# EasyEDA schematic SCH_stm-mainboard_2026-06-05.json
TITLE: Sheet_1; REV: 1.0; Date: 2026-06-05; Sheet: 1/1; Drawn By: farrelinoazikra; Company: Your Company
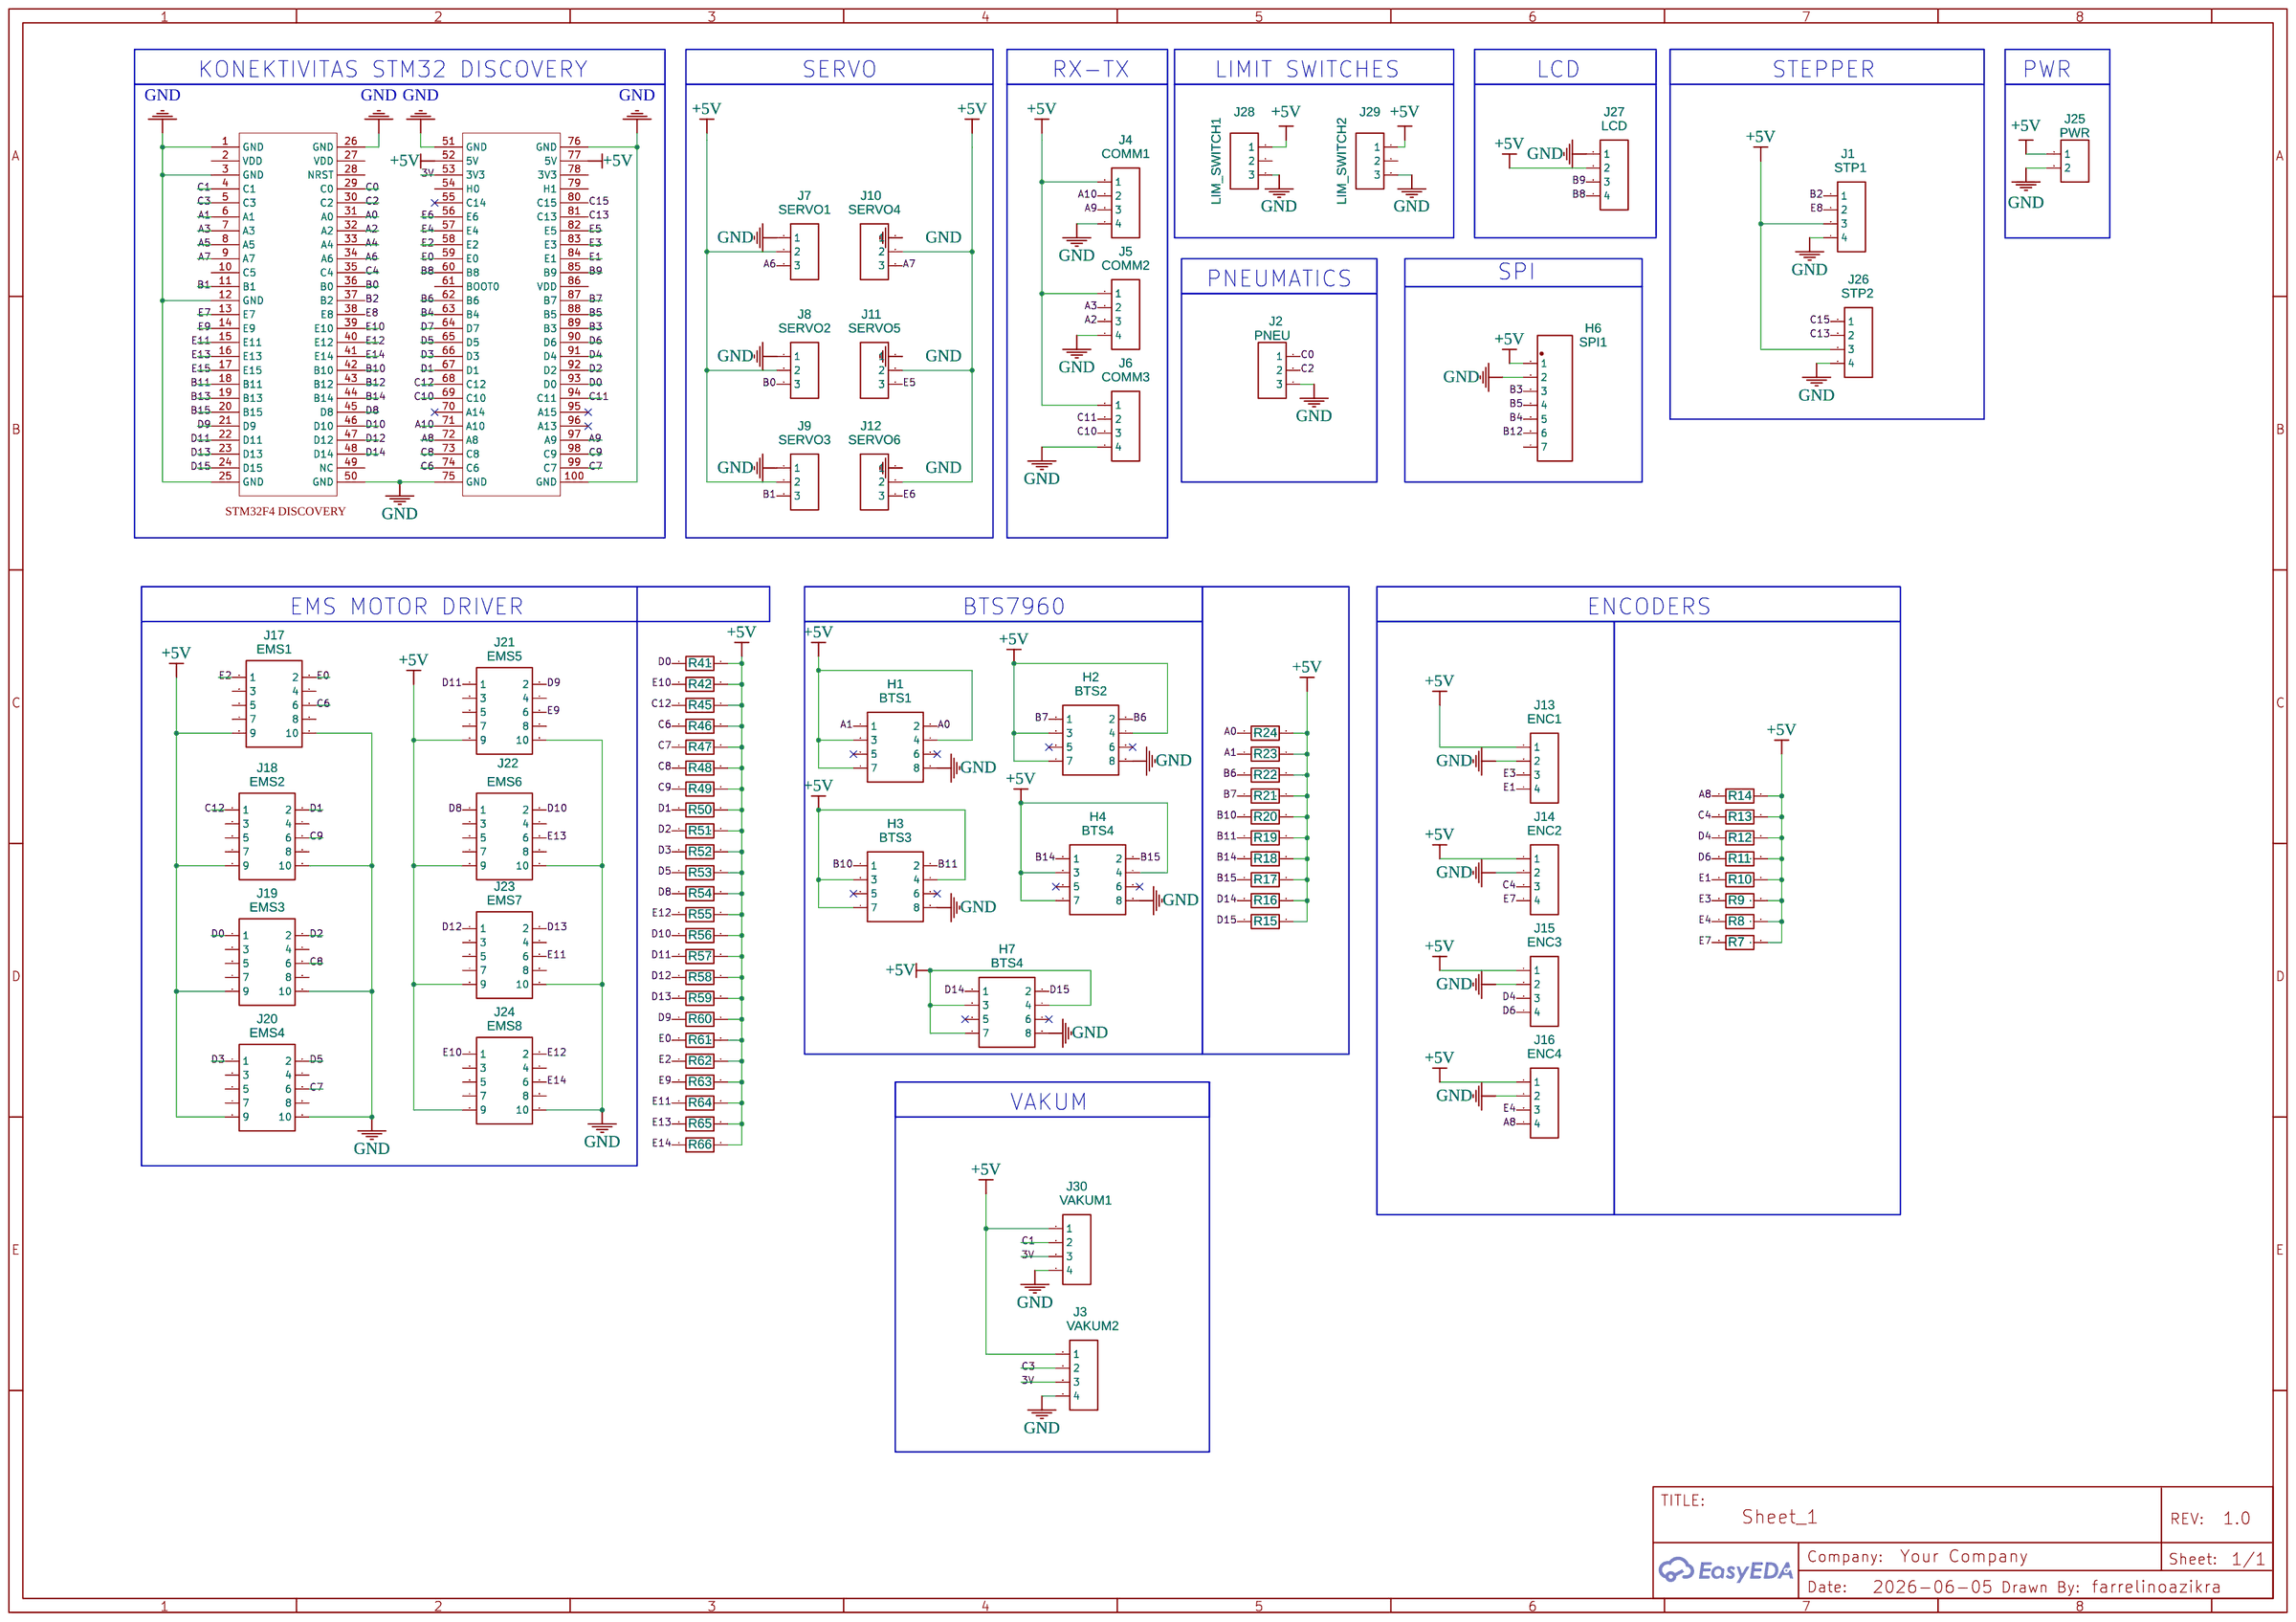
[diagram p0: schematic sheet]

## Parts
H1  BTS1  [HDR-F-2.54_2X4]
H2  BTS2  [HDR-F-2.54_2X4]
H3  BTS3  [HDR-F-2.54_2X4]
H4  BTS4  [HDR-F-2.54_2X4]
H6  SPI1  [210S-1X7P]
H7  BTS4  [HDR-F-2.54_2X4]
J1  STP1  [HDR-M-2.54_1X4]
J2  PNEU  [HDR-M-2.54_1X3]
J3  VAKUM2  [HDR-M-2.54_1X4]
J4  COMM1  [HDR-M-2.54_1X4]
J5  COMM2  [HDR-M-2.54_1X4]
J6  COMM3  [HDR-M-2.54_1X4]
J7  SERVO1  [HDR-M-2.54_1X3]
J8  SERVO2  [HDR-M-2.54_1X3]
J9  SERVO3  [HDR-M-2.54_1X3]
J10  SERVO4  [HDR-M-2.54_1X3]
J11  SERVO5  [HDR-M-2.54_1X3]
J12  SERVO6  [HDR-M-2.54_1X3]
J13  ENC1  [HDR-M-2.54_1X4]
J14  ENC2  [HDR-M-2.54_1X4]
J15  ENC3  [HDR-M-2.54_1X4]
J16  ENC4  [HDR-M-2.54_1X4]
J17  EMS1  [HDR-M-2.54_2X5]
J18  EMS2  [HDR-M-2.54_2X5]
J19  EMS3  [HDR-M-2.54_2X5]
J20  EMS4  [HDR-M-2.54_2X5]
J21  EMS5  [HDR-M-2.54_2X5]
J22  EMS6  [HDR-M-2.54_2X5]
J23  EMS7  [HDR-M-2.54_2X5]
J24  EMS8  [HDR-M-2.54_2X5]
J25  PWR  [HDR-M-2.54_1X2]
J26  STP2  [HDR-M-2.54_1X4]
J27  LCD  [HDR-M-2.54_1X4]
J28  LIM_SWITCH1  [HDR-M-2.54_1X3]
J29  LIM_SWITCH2  [HDR-M-2.54_1X3]
J30  VAKUM1  [HDR-M-2.54_1X4]
R7  1k  [R1206]
R8  1k  [R1206]
R9  1k  [R1206]
R10  1k  [R1206]
R11  1k  [R1206]
R12  1k  [R1206]
R13  1k  [R1206]
R14  1k  [R1206]
R15  1k  [R1206]
R16  1k  [R1206]
R17  1k  [R1206]
R18  1k  [R1206]
R19  1k  [R1206]
R20  1k  [R1206]
R21  1k  [R1206]
R22  1k  [R1206]
R23  1k  [R1206]
R24  1k  [R1206]
R41  1k  [R1206]
R42  1k  [R1206]
R45  1k  [R1206]
R46  1k  [R1206]
R47  1k  [R1206]
R48  1k  [R1206]
R49  1k  [R1206]
R50  1k  [R1206]
R51  1k  [R1206]
R52  1k  [R1206]
R53  1k  [R1206]
R54  1k  [R1206]
R55  1k  [R1206]
R56  1k  [R1206]
R57  1k  [R1206]
R58  1k  [R1206]
R59  1k  [R1206]
R60  1k  [R1206]
R61  1k  [R1206]
R62  1k  [R1206]
R63  1k  [R1206]
R64  1k  [R1206]
R65  1k  [R1206]
R66  1k  [R1206]
STM32F1DISCOVERY  STM32F4 Discovery  [STM32F4 DISCOVERY]

## Library data of the parts
H1-H4 H7 = HDR-F-2.54_2x4: Supplier Part: C239344; Supplier: LCSC; Contributor: LCEDA_Lib
H6 = Header-Male-2.54_1x7: Supplier: LCSC; Manufacturer: Ckmtw; Manufacturer Part: 210S-1*7P; Contributor: V.Vizniuk; Supplier Part: C124381
J1 J3-J6 J13-J16 J26 J27 J30 = HDR-M-2.54_1x4: Supplier Part: C124378; Supplier: LCSC; Contributor: LCEDA_Lib
J2 J7-J12 J28 J29 = HDR-M-2.54_1x3: Supplier Part: C180248; Supplier: LCSC; Contributor: LCEDA_Lib
J17-J24 = HDR-M-2.54_2x5: Supplier Part: C178292; Supplier: LCSC; Contributor: LCEDA_Lib
J25 = HDR-M-2.54_1x2: Supplier Part: C124375; Supplier: LCSC; Contributor: LCEDA_Lib
R7-R24 R41 R42 R45-R66 = R_1206_EU: Contributor: LCEDA_Lib
STM32F1DISCOVERY = -: Last Revision: 1 Jun 2017

## Nets
3V: J3.3 J30.3 STM32F1DISCOVERY.53(3V3)
+5V: H1.3 H1.4 H1.7 H2.3 H2.4 H2.7 H3.3 H3.4 H3.7 H4.3 H4.4 H4.7 H6.1 H7.3 H7.4 H7.7 J1.3 J3.1 J4.1 J5.1 J6.1 J7.2 J8.2 J9.2 J10.2 J11.2 J12.2 J13.1 J14.1 J15.1 J16.1 J17.9 J18.9 J19.9 J20.9 J21.9 J22.9 J23.9 J24.9 J25.1 J26.3 J27.2 J28.1 J29.1 J30.1 R7.2 R8.2 R9.2 R10.2 R11.2 R12.2 R13.2 R14.2 R15.2 R16.2 R17.2 R18.2 R19.2 R20.2 R21.2 R22.2 R23.2 R24.2 R41.2 R42.2 R45.2 R46.2 R47.2 R48.2 R49.2 R50.2 R51.2 R52.2 R53.2 R54.2 R55.2 R56.2 R57.2 R58.2 R59.2 R60.2 R61.2 R62.2 R63.2 R64.2 R65.2 R66.2 STM32F1DISCOVERY.52(5V) STM32F1DISCOVERY.77(5V)
GND: H1.8 H2.8 H3.8 H4.8 H6.2 H7.8 J1.4 J2.3 J3.4 J4.4 J5.4 J6.4 J7.1 J8.1 J9.1 J10.1 J11.1 J12.1 J13.2 J14.2 J15.2 J16.2 J17.10 J18.10 J19.10 J20.10 J21.10 J22.10 J23.10 J24.10 J25.2 J26.4 J27.1 J28.3 J29.3 J30.4 STM32F1DISCOVERY.1(GND) STM32F1DISCOVERY.3(GND) STM32F1DISCOVERY.12(GND) STM32F1DISCOVERY.25(GND) STM32F1DISCOVERY.26(GND) STM32F1DISCOVERY.50(GND) STM32F1DISCOVERY.51(GND) STM32F1DISCOVERY.75(GND) STM32F1DISCOVERY.76(GND) STM32F1DISCOVERY.100(GND)
A0: H1.2 R24.1 STM32F1DISCOVERY.31(A0)
A1: H1.1 R23.1 STM32F1DISCOVERY.6(A1)
A2: J5.3 STM32F1DISCOVERY.32(A2)
A3: J5.2 STM32F1DISCOVERY.7(A3)
A4: STM32F1DISCOVERY.33(A4)
A5: STM32F1DISCOVERY.8(A5)
A6: J7.3 STM32F1DISCOVERY.34(A6)
A7: J10.3 STM32F1DISCOVERY.9(A7)
A8: J16.4 R14.1 STM32F1DISCOVERY.72(A8)
A9: J4.3 STM32F1DISCOVERY.97(A9)
A10: J4.2 STM32F1DISCOVERY.71(A10)
B0: J8.3 STM32F1DISCOVERY.36(B0)
B1: J9.3 STM32F1DISCOVERY.11(B1)
B2: J1.1 STM32F1DISCOVERY.37(B2)
B3: H6.3 STM32F1DISCOVERY.89(B3)
B4: H6.5 STM32F1DISCOVERY.63(B4)
B5: H6.4 STM32F1DISCOVERY.88(B5)
B6: H2.2 R22.1 STM32F1DISCOVERY.62(B6)
B7: H2.1 R21.1 STM32F1DISCOVERY.87(B7)
B8: J27.4 STM32F1DISCOVERY.60(B8)
B9: J27.3 STM32F1DISCOVERY.85(B9)
B10: H3.1 R20.1 STM32F1DISCOVERY.42(B10)
B11: H3.2 R19.1 STM32F1DISCOVERY.18(B11)
B12: H6.6 STM32F1DISCOVERY.43(B12)
B13: STM32F1DISCOVERY.19(B13)
B14: H4.1 R18.1 STM32F1DISCOVERY.44(B14)
B15: H4.2 R17.1 STM32F1DISCOVERY.20(B15)
C0: J2.1 STM32F1DISCOVERY.29(C0)
C1: J30.2 STM32F1DISCOVERY.4(C1)
C2: J2.2 STM32F1DISCOVERY.30(C2)
C3: J3.2 STM32F1DISCOVERY.5(C3)
C4: J14.3 R13.1 STM32F1DISCOVERY.35(C4)
C6: J17.6 R46.1 STM32F1DISCOVERY.74(C6)
C7: J20.6 R47.1 STM32F1DISCOVERY.99(C7)
C8: J19.6 R48.1 STM32F1DISCOVERY.73(C8)
C9: J18.6 R49.1 STM32F1DISCOVERY.98(C9)
C10: J6.3 STM32F1DISCOVERY.69(C10)
C11: J6.2 STM32F1DISCOVERY.94(C11)
C12: J18.1 R45.1 STM32F1DISCOVERY.68(C12)
C13: J26.2 STM32F1DISCOVERY.81(C13)
C15: J26.1 STM32F1DISCOVERY.80(C15)
D0: J19.1 R41.1 STM32F1DISCOVERY.93(D0)
D1: J18.2 R50.1 STM32F1DISCOVERY.67(D1)
D2: J19.2 R51.1 STM32F1DISCOVERY.92(D2)
D3: J20.1 R52.1 STM32F1DISCOVERY.66(D3)
D4: J15.3 R12.1 STM32F1DISCOVERY.91(D4)
D5: J20.2 R53.1 STM32F1DISCOVERY.65(D5)
D6: J15.4 R11.1 STM32F1DISCOVERY.90(D6)
D7: STM32F1DISCOVERY.64(D7)
D8: J22.1 R54.1 STM32F1DISCOVERY.45(D8)
D9: J21.2 R60.1 STM32F1DISCOVERY.21(D9)
D10: J22.2 R56.1 STM32F1DISCOVERY.46(D10)
D11: J21.1 R57.1 STM32F1DISCOVERY.22(D11)
D12: J23.1 R58.1 STM32F1DISCOVERY.47(D12)
D13: J23.2 R59.1 STM32F1DISCOVERY.23(D13)
D14: H7.1 R16.1 STM32F1DISCOVERY.48(D14)
D15: H7.2 R15.1 STM32F1DISCOVERY.24(D15)
E0: J17.2 R61.1 STM32F1DISCOVERY.59(E0)
E1: J13.4 R10.1 STM32F1DISCOVERY.84(E1)
E2: J17.1 R62.1 STM32F1DISCOVERY.58(E2)
E3: J13.3 R9.1 STM32F1DISCOVERY.83(E3)
E4: J16.3 R8.1 STM32F1DISCOVERY.57(E4)
E5: J11.3 STM32F1DISCOVERY.82(E5)
E6: J12.3 STM32F1DISCOVERY.56(E6)
E7: J14.4 R7.1 STM32F1DISCOVERY.13(E7)
E8: J1.2 STM32F1DISCOVERY.38(E8)
E9: J21.6 R63.1 STM32F1DISCOVERY.14(E9)
E10: J24.1 R42.1 STM32F1DISCOVERY.39(E10)
E11: J23.6 R64.1 STM32F1DISCOVERY.15(E11)
E12: J24.2 R55.1 STM32F1DISCOVERY.40(E12)
E13: J22.6 R65.1 STM32F1DISCOVERY.16(E13)
E14: J24.6 R66.1 STM32F1DISCOVERY.41(E14)
E15: STM32F1DISCOVERY.17(E15)

Not connected (* = marked no-connect by the designer): H1 5* 6*; H2 5* 6*; H3 5* 6*; H4 5* 6*; H6 7; H7 5* 6*; J17 3 4 5 7 8; J18 3 4 5 7 8; J19 3 4 5 7 8; J20 3 4 5 7 8; J21 3 4 5 7 8; J22 3 4 5 7 8; J23 3 4 5 7 8; J24 3 4 5 7 8; J28 2; J29 2; STM32F1DISCOVERY 2(VDD) 10(C5) 27(VDD) 28(NRST) 49(NC) 54(H0) 55(C14)* 61(BOOT0) 70(A14)* 78(3V3) 79(H1) 86(VDD) 95(A15)* 96(A13)*

## Notes on the sheet
- KONEKTIVITAS STM32 DISCOVERY
- SERVO
- RX-TX
- LIMIT SWITCHES
- LCD
- STEPPER
- PWR
- PNEUMATICS
- SPI
- EMS MOTOR DRIVER
- BTS7960
- ENCODERS
- VAKUM
